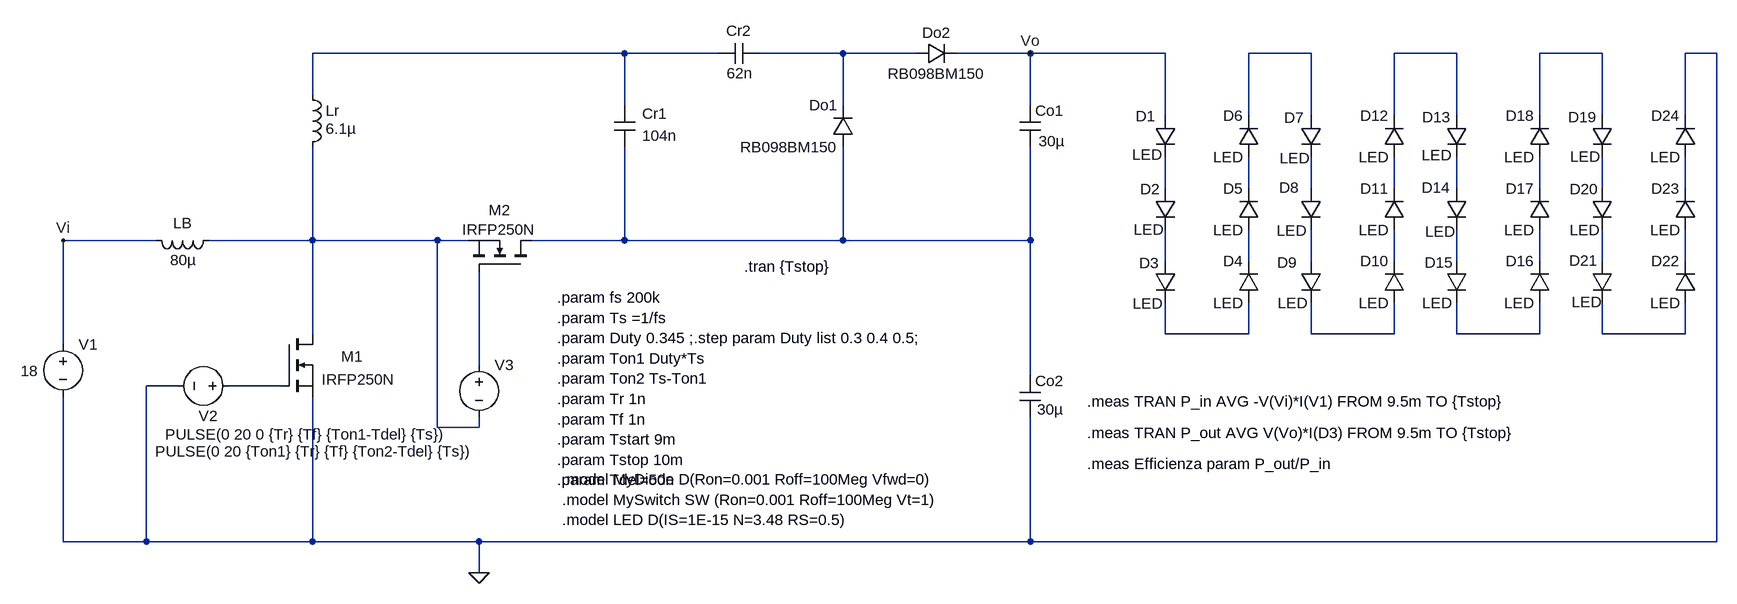
[diagram p0: schematic reale.asc]
reale.asc, the LTspice schematic file:
Version 4.1
SHEET 1 3448 2144
WIRE 352 -128 -128 -128
WIRE 496 -128 352 -128
WIRE 688 -128 560 -128
WIRE 800 -128 688 -128
WIRE 976 -128 864 -128
WIRE 1184 -128 976 -128
WIRE 1408 -128 1312 -128
WIRE 1632 -128 1536 -128
WIRE 1856 -128 1760 -128
WIRE 2032 -128 1984 -128
WIRE -128 -64 -128 -128
WIRE 352 -48 352 -128
WIRE 688 -48 688 -128
WIRE 976 -48 976 -128
WIRE 1184 -32 1184 -128
WIRE 1312 -32 1312 -128
WIRE 1408 -32 1408 -128
WIRE 1536 -32 1536 -128
WIRE 1632 -32 1632 -128
WIRE 1760 -32 1760 -128
WIRE 1856 -32 1856 -128
WIRE 1984 -32 1984 -128
WIRE 1184 80 1184 32
WIRE 1312 80 1312 32
WIRE 1408 80 1408 32
WIRE 1536 80 1536 32
WIRE 1632 80 1632 32
WIRE 1760 80 1760 32
WIRE 1856 80 1856 32
WIRE 1984 80 1984 32
WIRE -368 160 -512 160
WIRE -128 160 -128 16
WIRE -128 160 -288 160
WIRE 64 160 -128 160
WIRE 112 160 64 160
WIRE 352 160 352 16
WIRE 352 160 208 160
WIRE 688 160 688 16
WIRE 688 160 352 160
WIRE 976 160 976 16
WIRE 976 160 688 160
WIRE 1184 192 1184 144
WIRE 1312 192 1312 144
WIRE 1408 192 1408 144
WIRE 1536 192 1536 144
WIRE 1632 192 1632 144
WIRE 1760 192 1760 144
WIRE 1856 192 1856 144
WIRE 1984 192 1984 144
WIRE -128 304 -128 160
WIRE 1184 304 1184 256
WIRE 1312 304 1312 256
WIRE 1312 304 1184 304
WIRE 1408 304 1408 256
WIRE 1536 304 1536 256
WIRE 1536 304 1408 304
WIRE 1632 304 1632 256
WIRE 1760 304 1760 256
WIRE 1760 304 1632 304
WIRE 1856 304 1856 256
WIRE 1984 304 1984 256
WIRE 1984 304 1856 304
WIRE -512 320 -512 160
WIRE 128 352 128 208
WIRE 976 368 976 160
WIRE -336 384 -384 384
WIRE -176 384 -256 384
WIRE 64 448 64 160
WIRE 128 448 128 432
WIRE 128 448 64 448
WIRE -512 624 -512 400
WIRE -384 624 -384 384
WIRE -384 624 -512 624
WIRE -128 624 -128 400
WIRE -128 624 -384 624
WIRE 128 624 -128 624
WIRE 976 624 976 432
WIRE 976 624 128 624
WIRE 2032 624 2032 -128
WIRE 2032 624 976 624
WIRE 128 672 128 624
FLAG 128 672 0
FLAG 976 -128 Vo
FLAG -512 160 Vi
SYMBOL cap 336 -48 R0
WINDOW 0 43 13 Left 2
WINDOW 3 43 47 Left 2
SYMATTR InstName Cr1
SYMATTR Value 104n
SYMBOL cap 560 -144 R90
WINDOW 0 -3 32 VBottom 2
WINDOW 3 62 31 VBottom 2
SYMATTR InstName Cr2
SYMATTR Value 62n
SYMBOL cap 960 -48 R0
WINDOW 3 29 55 Left 2
SYMATTR Value 30µ
SYMATTR InstName Co1
SYMBOL cap 960 368 R0
WINDOW 3 27 52 Left 2
SYMATTR Value 30µ
SYMATTR InstName Co2
SYMBOL ind -144 -80 R0
WINDOW 3 36 68 Left 2
SYMATTR Value 6.1µ
SYMATTR InstName Lr
SYMBOL ind -272 144 R90
WINDOW 0 5 56 VBottom 2
WINDOW 3 62 55 VBottom 2
SYMATTR InstName LB
SYMATTR Value 80µ
SYMBOL voltage -512 304 R0
WINDOW 123 0 0 Left 0
WINDOW 39 0 0 Left 0
WINDOW 3 -65 57 Left 2
SYMATTR Value 18
SYMATTR InstName V1
SYMBOL voltage -240 384 R90
WINDOW 123 0 0 Left 0
WINDOW 39 0 0 Left 0
WINDOW 3 75 -323 VRight 2
WINDOW 0 46 34 VRight 2
SYMATTR Value PULSE(0 20 0 {Tr} {Tf} {Ton1-Tdel} {Ts})
SYMATTR InstName V2
SYMBOL voltage 128 336 R0
WINDOW 123 0 0 Left 0
WINDOW 39 0 0 Left 0
WINDOW 3 -498 149 Left 2
SYMATTR Value PULSE(0 20 {Ton1} {Tr} {Tf} {Ton2-Tdel} {Ts})
SYMATTR InstName V3
SYMBOL diode 704 16 R180
WINDOW 0 24 64 Left 2
WINDOW 3 24 0 Left 2
SYMATTR InstName Do1
SYMATTR Value RB098BM150
SYMBOL diode 800 -112 R270
WINDOW 0 32 32 VTop 2
WINDOW 3 0 32 VBottom 2
SYMATTR InstName Do2
SYMATTR Value RB098BM150
SYMBOL nmos -176 304 R0
WINDOW 0 92 35 Left 2
WINDOW 3 62 70 Left 2
SYMATTR InstName M1
SYMATTR Value IRFP250N
SYMBOL nmos 208 208 M270
WINDOW 0 95 65 VLeft 2
WINDOW 3 65 106 VLeft 2
SYMATTR InstName M2
SYMATTR Value IRFP250N
SYMBOL diode 1168 -32 R0
WINDOW 0 -30 1 Left 2
WINDOW 3 -35 60 Left 2
SYMATTR InstName D1
SYMATTR Value LED
SYMBOL diode 1168 80 R0
WINDOW 0 -23 1 Left 2
WINDOW 3 -33 63 Left 2
SYMATTR InstName D2
SYMATTR Value LED
SYMBOL diode 1168 192 R0
WINDOW 0 -24 3 Left 2
WINDOW 3 -34 65 Left 2
SYMATTR InstName D3
SYMATTR Value LED
SYMBOL diode 1328 256 R180
WINDOW 0 24 64 Left 2
WINDOW 3 24 0 Left 2
SYMATTR InstName D4
SYMATTR Value LED
SYMBOL diode 1328 144 R180
WINDOW 0 24 64 Left 2
WINDOW 3 24 0 Left 2
SYMATTR InstName D5
SYMATTR Value LED
SYMBOL diode 1328 32 R180
WINDOW 0 24 64 Left 2
WINDOW 3 24 0 Left 2
SYMATTR InstName D6
SYMATTR Value LED
SYMBOL diode 1392 -32 R0
WINDOW 0 -25 3 Left 2
WINDOW 3 -32 65 Left 2
SYMATTR InstName D7
SYMATTR Value LED
SYMBOL diode 1392 80 R0
WINDOW 0 -33 -1 Left 2
WINDOW 3 -37 65 Left 2
SYMATTR InstName D8
SYMATTR Value LED
SYMBOL diode 1392 192 R0
WINDOW 0 -36 2 Left 2
WINDOW 3 -35 64 Left 2
SYMATTR InstName D9
SYMATTR Value LED
SYMBOL diode 1552 256 R180
WINDOW 0 24 64 Left 2
WINDOW 3 24 0 Left 2
SYMATTR InstName D10
SYMATTR Value LED
SYMBOL diode 1552 144 R180
WINDOW 0 24 64 Left 2
WINDOW 3 24 0 Left 2
SYMATTR InstName D11
SYMATTR Value LED
SYMBOL diode 1552 32 R180
WINDOW 0 24 64 Left 2
WINDOW 3 24 0 Left 2
SYMATTR InstName D12
SYMATTR Value LED
SYMBOL diode 1616 -32 R0
WINDOW 0 -37 2 Left 2
WINDOW 3 -38 61 Left 2
SYMATTR InstName D13
SYMATTR Value LED
SYMBOL diode 1616 80 R0
WINDOW 0 -38 -1 Left 2
WINDOW 3 -32 66 Left 2
SYMATTR InstName D14
SYMATTR Value LED
SYMBOL diode 1616 192 R0
WINDOW 0 -33 2 Left 2
WINDOW 3 -37 64 Left 2
SYMATTR InstName D15
SYMATTR Value LED
SYMBOL diode 1776 256 R180
WINDOW 0 24 64 Left 2
WINDOW 3 24 0 Left 2
SYMATTR InstName D16
SYMATTR Value LED
SYMBOL diode 1776 144 R180
WINDOW 0 24 64 Left 2
WINDOW 3 24 0 Left 2
SYMATTR InstName D17
SYMATTR Value LED
SYMBOL diode 1776 32 R180
WINDOW 0 24 64 Left 2
WINDOW 3 24 0 Left 2
SYMATTR InstName D18
SYMATTR Value LED
SYMBOL diode 1840 -32 R0
WINDOW 0 -36 2 Left 2
WINDOW 3 -33 63 Left 2
SYMATTR InstName D19
SYMATTR Value LED
SYMBOL diode 1840 80 R0
WINDOW 0 -34 1 Left 2
WINDOW 3 -34 64 Left 2
SYMATTR InstName D20
SYMATTR Value LED
SYMBOL diode 1840 192 R0
WINDOW 0 -35 -1 Left 2
WINDOW 3 -31 63 Left 2
SYMATTR InstName D21
SYMATTR Value LED
SYMBOL diode 2000 256 R180
WINDOW 0 24 64 Left 2
WINDOW 3 24 0 Left 2
SYMATTR InstName D22
SYMATTR Value LED
SYMBOL diode 2000 144 R180
WINDOW 0 24 64 Left 2
WINDOW 3 24 0 Left 2
SYMATTR InstName D23
SYMATTR Value LED
SYMBOL diode 2000 32 R180
WINDOW 0 24 64 Left 2
WINDOW 3 24 0 Left 2
SYMATTR InstName D24
SYMATTR Value LED
TEXT 536 200 Left 2 !.tran {Tstop}
TEXT 248 248 Left 2 !.param fs 200k\n.param Ts =1/fs\n.param Duty 0.345 ;.step param Duty list 0.3 0.4 0.5;\n.param Ton1 Duty*Ts\n.param Ton2 Ts-Ton1\n.param Tr 1n\n.param Tf 1n\n.param Tstart 9m\n.param Tstop 10m\n.param Tdel=50n
TEXT 256 528 Left 2 !.model MyDiode D(Ron=0.001 Roff=100Meg Vfwd=0)\n.model MySwitch SW (Ron=0.001 Roff=100Meg Vt=1)\n.model LED D(IS=1E-15 N=3.48 RS=0.5)
TEXT 1064 408 Left 2 !.meas TRAN P_in AVG -V(Vi)*I(V1) FROM 9.5m TO {Tstop}
TEXT 1064 456 Left 2 !.meas TRAN P_out AVG V(Vo)*I(D3) FROM 9.5m TO {Tstop}
TEXT 1064 504 Left 2 !.meas Efficienza param P_out/P_in

The netlist it stands for:
* reale.asc
Cr1 N001 N015 104n
Cr2 N002 N001 62n
Co1 Vo N015 30µ
Co2 N015 0 30µ
Lr N001 N014 6.1µ
LB N014 Vi 80µ
V1 Vi 0 18
V2 N029 0 PULSE(0 20 0 {Tr} {Tf} {Ton1-Tdel} {Ts})
V3 N028 N014 PULSE(0 20 {Ton1} {Tr} {Tf} {Ton2-Tdel} {Ts})
Do1 N015 N002 RB098BM150
Do2 N002 Vo RB098BM150
M1 N014 N029 0 0 IRFP250N
M2 N015 N028 N014 N014 IRFP250N
D1 Vo N006 LED
D2 N006 N016 LED
D3 N016 N024 LED
D4 N024 N017 LED
D5 N017 N007 LED
D6 N007 N003 LED
D7 N003 N008 LED
D8 N008 N018 LED
D9 N018 N025 LED
D10 N025 N019 LED
D11 N019 N009 LED
D12 N009 N004 LED
D13 N004 N010 LED
D14 N010 N020 LED
D15 N020 N026 LED
D16 N026 N021 LED
D17 N021 N011 LED
D18 N011 N005 LED
D19 N005 N012 LED
D20 N012 N022 LED
D21 N022 N027 LED
D22 N027 N023 LED
D23 N023 N013 LED
D24 N013 0 LED
.model D D
.lib standard.dio
.model NMOS NMOS
.model PMOS PMOS
.lib standard.mos
.tran {Tstop}
.param fs 200k
.param Ts =1/fs
.param Duty 0.345 ;.step param Duty list 0.3 0.4 0.5;
.param Ton1 Duty*Ts
.param Ton2 Ts-Ton1
.param Tr 1n
.param Tf 1n
.param Tstart 9m
.param Tstop 10m
.param Tdel=50n
.model MyDiode D(Ron=0.001 Roff=100Meg Vfwd=0)
.model MySwitch SW (Ron=0.001 Roff=100Meg Vt=1)
.model LED D(IS=1E-15 N=3.48 RS=0.5)
.meas TRAN P_in AVG -V(Vi)*I(V1) FROM 9.5m TO {Tstop}
.meas TRAN P_out AVG V(Vo)*I(D3) FROM 9.5m TO {Tstop}
.meas Efficienza param P_out/P_in
.backanno
.end